# EAGLE schematic zeroport (EAGLE 7.6.0)
CNAME: timebox controller; CREVISION: 1.0; DESIGNER: volzo
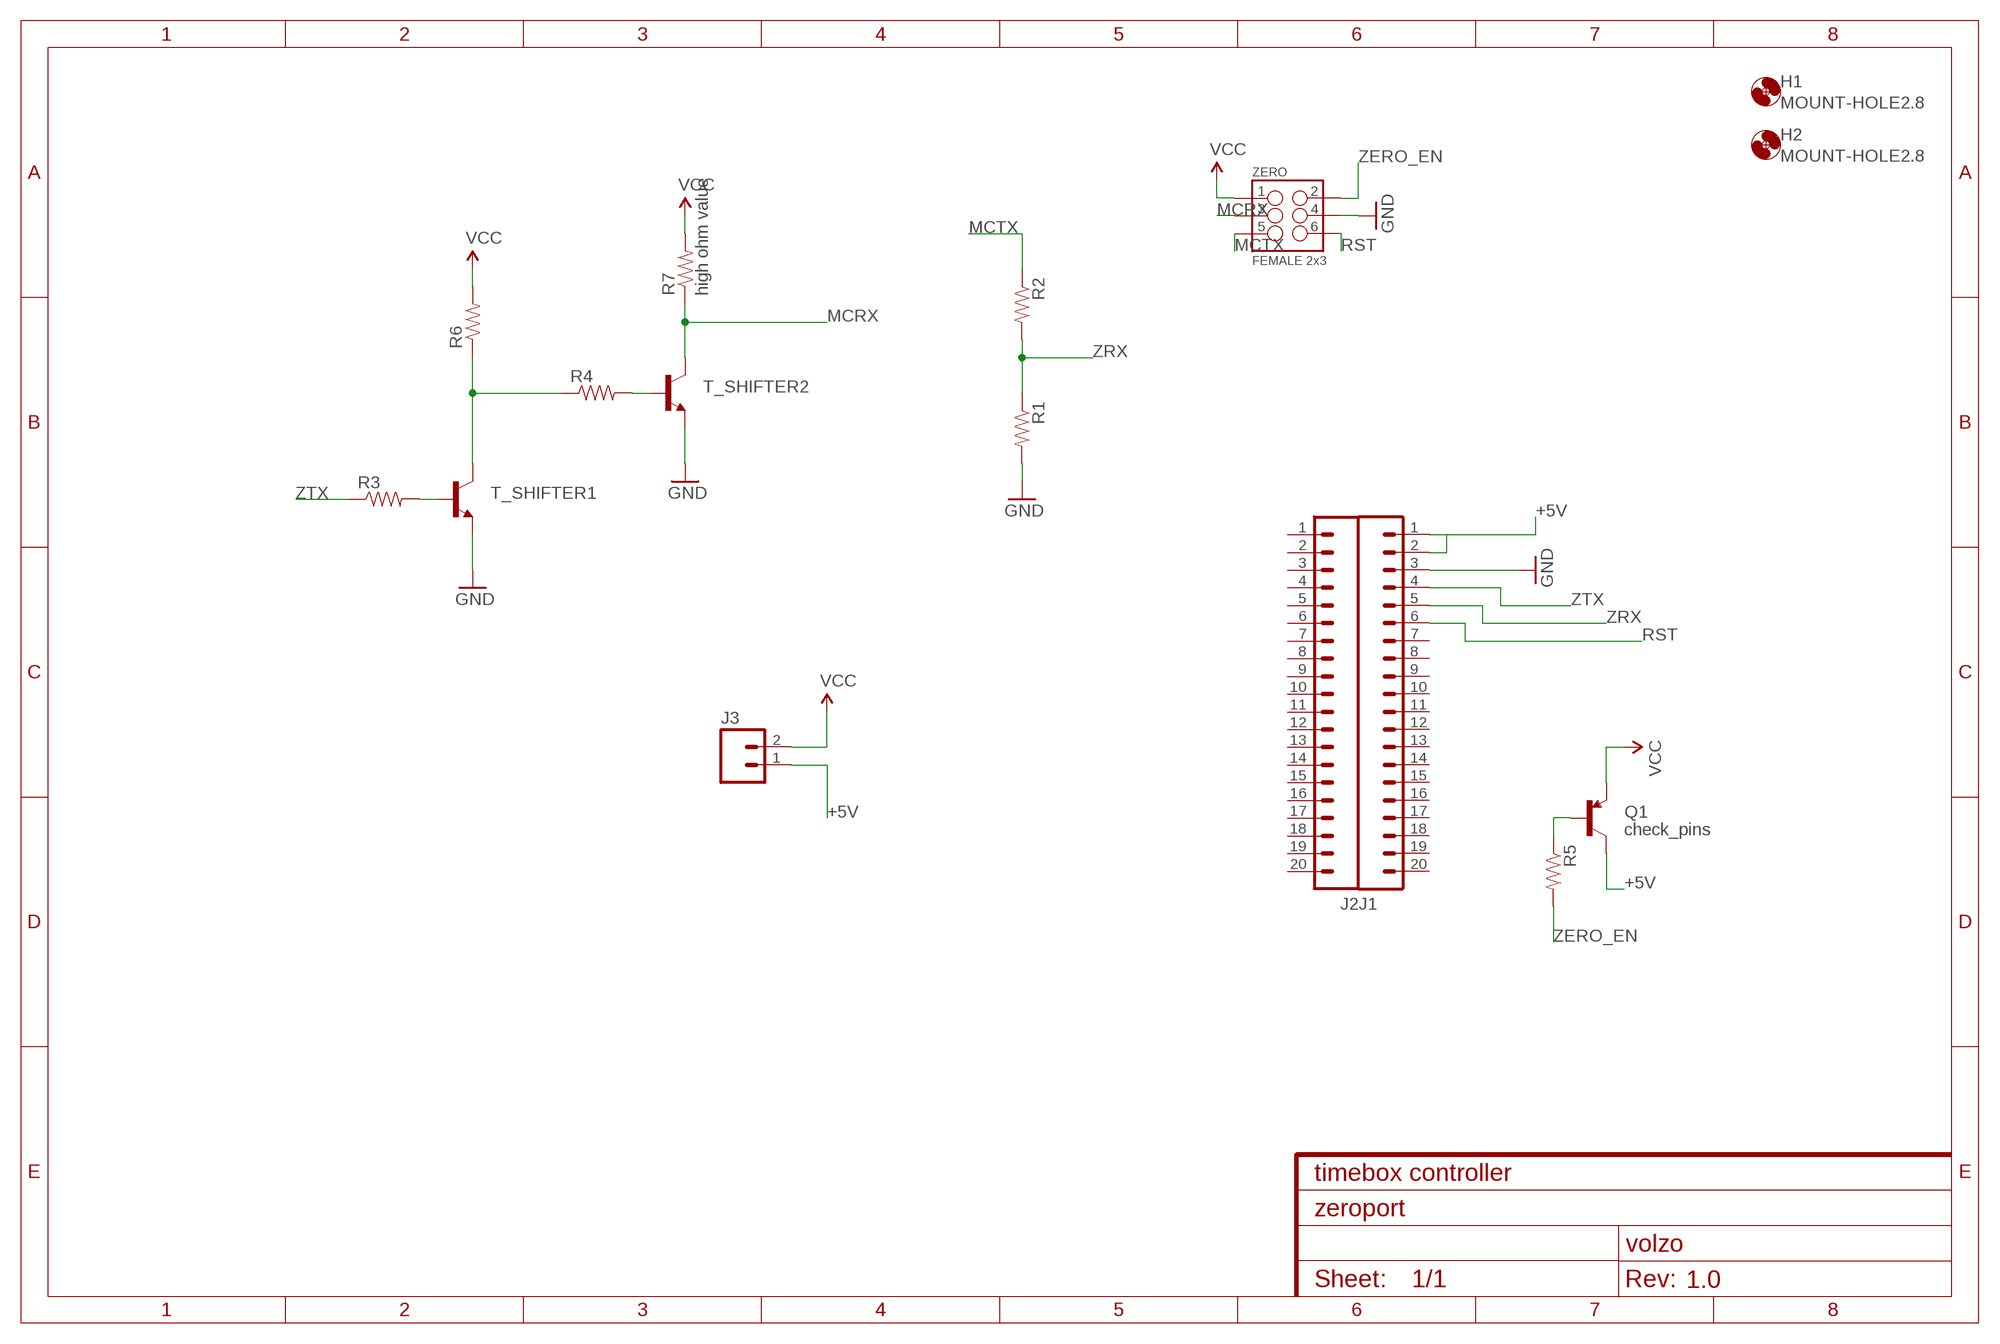
[diagram p0: schematic, sheet 1]

## Parts
H1  MOUNT-HOLE2.8  [2,8]
H2  MOUNT-HOLE2.8  [2,8]
J1  M20LOCK  [1X20_LOCK]
J2  M20LOCK  [1X20_LOCK]
J3  M02LOCK  [1X02_LOCK]
Q1  check_pins  TRANSISTOR_PNPTO92  [TO-92]
R1  RESISTORPTH-1/4W  [AXIAL-0.4]
R2  RESISTORPTH-1/4W  [AXIAL-0.4]
R3  RESISTORPTH-1/4W  [AXIAL-0.4]
R4  RESISTORPTH-1/4W  [AXIAL-0.4]
R5  RESISTORPTH-1/4W  [AXIAL-0.4]
R6  RESISTORPTH-1/4W  [AXIAL-0.4]
R7  high ohm value  RESISTORPTH-1/4W  [AXIAL-0.4]
T_SHIFTER1  TRANSISTOR_NPN2N3904  [TO-92]
T_SHIFTER2  TRANSISTOR_NPN2N3904  [TO-92]
ZERO  FEMALE 2x3  M03X2FEMALE  [2X3]

## Nets
+5V: J1.1 J3.1 Q1.3(C)
GND: J1.3 R1.P$2 T_SHIFTER1.1(E) T_SHIFTER2.1(E) ZERO.4
MCRX: R7.P$1 T_SHIFTER2.3(C) ZERO.3
MCTX: R2.P$1 ZERO.5
N$2: Q1.2(B) R5.P$1
N$3: J1.2
N$4: R3.P$2 T_SHIFTER1.2(B)
N$5: R4.P$1 R6.P$1 T_SHIFTER1.3(C)
N$6: R4.P$2 T_SHIFTER2.2(B)
RST: J1.6 ZERO.6
VCC: J3.2 Q1.1(E) R6.P$2 R7.P$2 ZERO.1
ZERO_EN: R5.P$2 ZERO.2
ZRX: J1.5 R1.P$1 R2.P$2
ZTX: J1.4 R3.P$1
Unconnected: J1.7 J1.8 J1.9 J1.10 J1.11 J1.12 J1.13 J1.14 J1.15 J1.16 J1.17 J1.18 J1.19 J1.20 J2.1 J2.2 J2.3 J2.4 J2.5 J2.6 J2.7 J2.8 J2.9 J2.10 J2.11 J2.12 J2.13 J2.14 J2.15 J2.16 J2.17 J2.18 J2.19 J2.20

## Library data of the parts
H1 H2 = holes:MOUNT-HOLE: MOUNTING HOLE with drill center marker
J1 J2 = SparkFun-Connectors:M20: 1x20 .1" header This is just like the LOCK variant in that the holes are staggared by 5 mil, but except for the last two holes. They are not altered from the "standard" footprint layout. This is used for a special purpose on the layout of our Graphic LCD Backpack. Make sure you want to use this device before selecting it for you project!
J3 = SparkFun-Connectors:M02: Standard 2-pin 0.1" header. Use with - straight break away headers ( PRT-00116) - right angle break away headers (PRT-00553) - swiss pins (PRT-00743) - machine pins (PRT-00117) - female headers (PRT-00115) Molex polarized connector foot print use with: PRT-08233 with associated crimp pins and housings. 2.54_SCREWTERM for use with PRT-10571. 3.5mm Screw Terminal footprints for PRT-08084 5mm Screw Terminal footprints for use with PRT-08432
Q1 = SparkFun-DiscreteSemi:TRANSISTOR_PNP: Generic PNP BJT Double check pinouts against datasheets- not all devices are the same! MMBT3906 - 40V 200mA SOT-23 (TRANS-08052) MMBT4403 - 40V 600mA SOT-23 (TRANS-09245)
R1-R7 = SparkFun-Resistors:RESISTOR: Resistor Basic schematic elements and footprints for 0603, 1206, and PTH resistors.
T_SHIFTER1 T_SHIFTER2 = SparkFun-DiscreteSemi:TRANSISTOR_NPN: Generic NPN BJT MMBT2222A - TRANS-08049 (SOT-23, 1A 40V) MPSA42 - TRANS-09116 (SOT-23, 500mA 300V) MMBT5088LT1G - TRANS-11160 (SOT-23, 50 mA 30V) BC547 - COM-08928 <http://www.sparkfun.com/products/8928> (TO-92 45V 100mA) (1.Collector 2.Base 3.Emitter) 2N3904 - COM-00521 <http://www.sparkfun.com/products/521> (TO-92 40V 200mA) (1.Emitter 2.Base 3.Collector) P2N2222A - COM-12852 <http://www.sparkfun.com/products/12852> (TO-92 40V 600mA) (1.Collector 2.Base 3.Emitter); PROD_ID: TRANS-08447
ZERO = SparkFun-Connectors:M03X2: 2x3 .1" header. Shrouded, with keying- CONN-10681 SMT- CONN-11415 Pogo pins- HW-11044; PROD_ID: CONN-11566

## Net classes
0 default: width 0.508 mm, clearance 0.254 mm
1 power: width 0.762 mm, clearance 0.254 mm